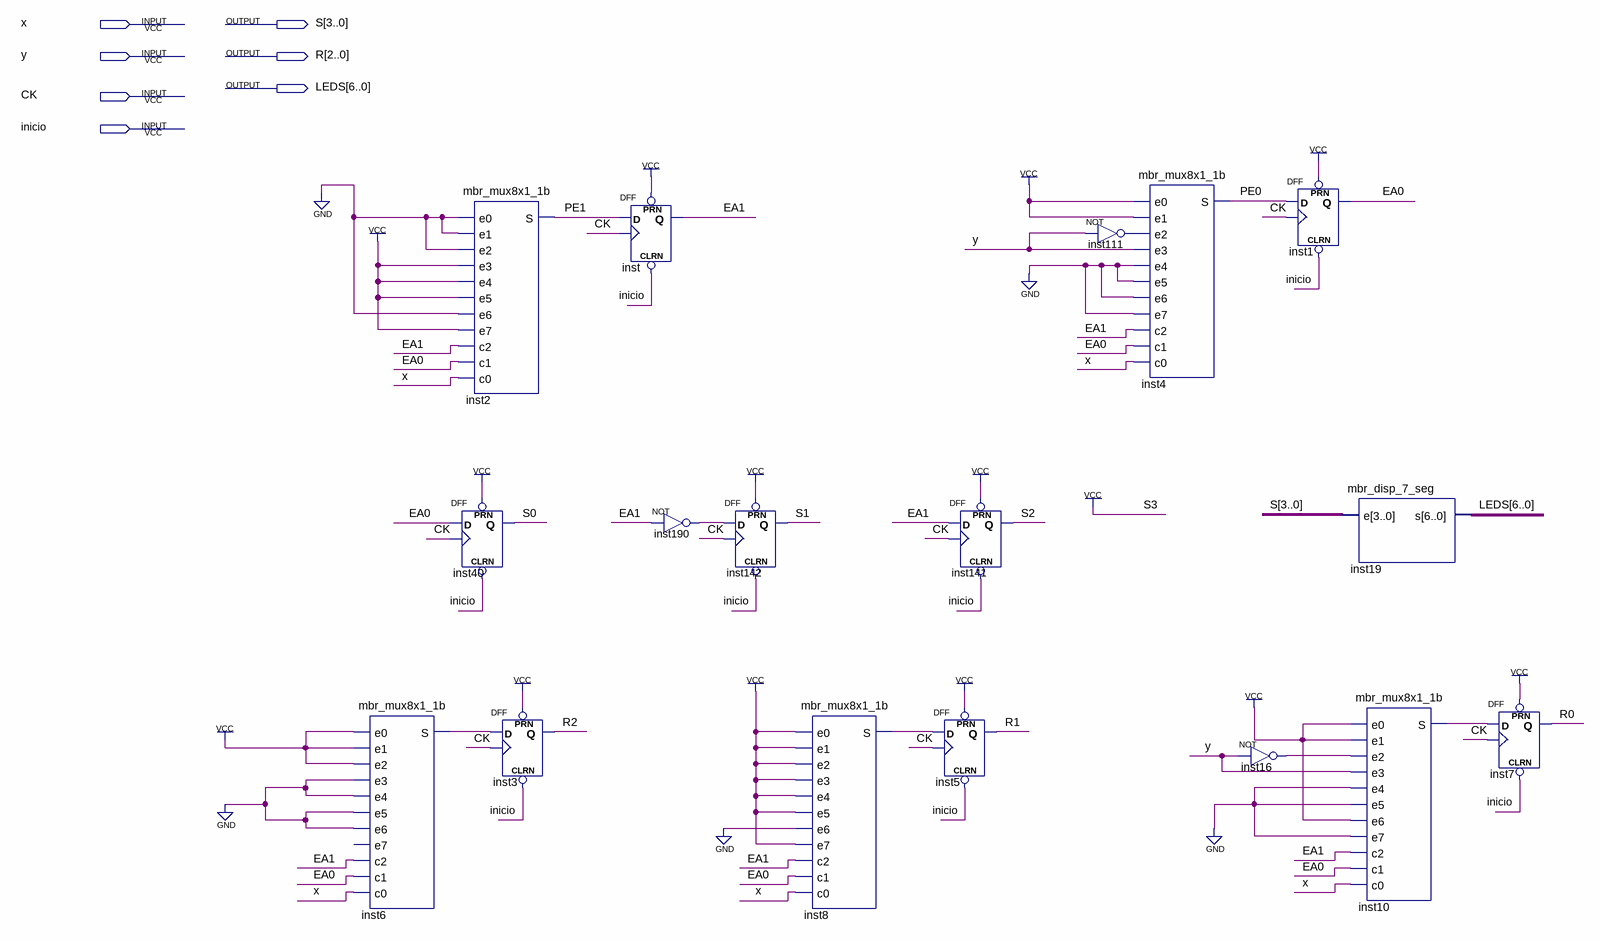
[diagram p0: schematic sheet]
// Quartus schematic mbr_fsm.bdf as structural Verilog: 17 symbols, 7 pins
module mbr_fsm (
  input  x,
  input  y,
  input  CK,
  input  inicio,
  output [3:0] S,
  output [2:0] R,
  output [6:0] LEDS
);

  wire EA0, EA1, inst6_s, inst8_s, inst10_s, inst16_out, inst111_out, inst190_out, PE0, PE1;

  mbr_mux8x1_1b inst6 (
    .e0(1'b1), .e1(1'b1), .e2(1'b1), .e3(1'b0), .e4(1'b0), .e5(1'b0), .e6(1'b0), .c2(EA1), .c1(EA0), .c0(x),
    .S(inst6_s));  // open: e7
  mbr_mux8x1_1b inst2 (
    .e0(1'b0), .e1(1'b0), .e2(1'b0), .e3(1'b1), .e4(1'b1), .e5(1'b1), .e6(1'b0), .e7(1'b1), .c2(EA1),
    .c1(EA0), .c0(x), .S(PE1));
  DFF inst40 (.CLRN(inicio), .CLK(CK), .D(EA0), .PRN(1'b1), .Q(S[0]));
  DFF inst3 (.CLRN(inicio), .CLK(CK), .D(inst6_s), .PRN(1'b1), .Q(R[2]));
  DFF inst (.CLRN(inicio), .CLK(CK), .D(PE1), .PRN(1'b1), .Q(EA1));
  not inst190 (inst190_out, EA1);
  DFF inst142 (.CLRN(inicio), .CLK(CK), .D(inst190_out), .PRN(1'b1), .Q(S[1]));
  mbr_mux8x1_1b inst8 (
    .e0(1'b1), .e1(1'b1), .e2(1'b1), .e3(1'b1), .e4(1'b1), .e5(1'b1), .e6(1'b0), .e7(1'b1), .c2(EA1),
    .c1(EA0), .c0(x), .S(inst8_s));
  DFF inst5 (.CLRN(inicio), .CLK(CK), .D(inst8_s), .PRN(1'b1), .Q(R[1]));
  DFF inst141 (.CLRN(inicio), .CLK(CK), .D(EA1), .PRN(1'b1), .Q(S[2]));
  not inst111 (inst111_out, y);
  mbr_mux8x1_1b inst4 (
    .e0(1'b1), .e1(1'b1), .e2(inst111_out), .e3(y), .e4(1'b0), .e5(1'b0), .e6(1'b0), .e7(1'b0), .c2(EA1),
    .c1(EA0), .c0(x), .S(PE0));
  not inst16 (inst16_out, y);
  DFF inst1 (.CLRN(inicio), .CLK(CK), .D(PE0), .PRN(1'b1), .Q(EA0));
  mbr_disp_7_seg inst19 (.e({1'b1, S[2:0]}), .s(LEDS));
  mbr_mux8x1_1b inst10 (
    .e0(1'b1), .e1(1'b1), .e2(inst16_out), .e3(y), .e4(1'b0), .e5(1'b0), .e6(1'b1), .e7(1'b0), .c2(EA1),
    .c1(EA0), .c0(x), .S(inst10_s));
  DFF inst7 (.CLRN(inicio), .CLK(CK), .D(inst10_s), .PRN(1'b1), .Q(R[0]));

  assign S[3] = 1'b1;
endmodule
